# Altium project CMUX.PrjPcb
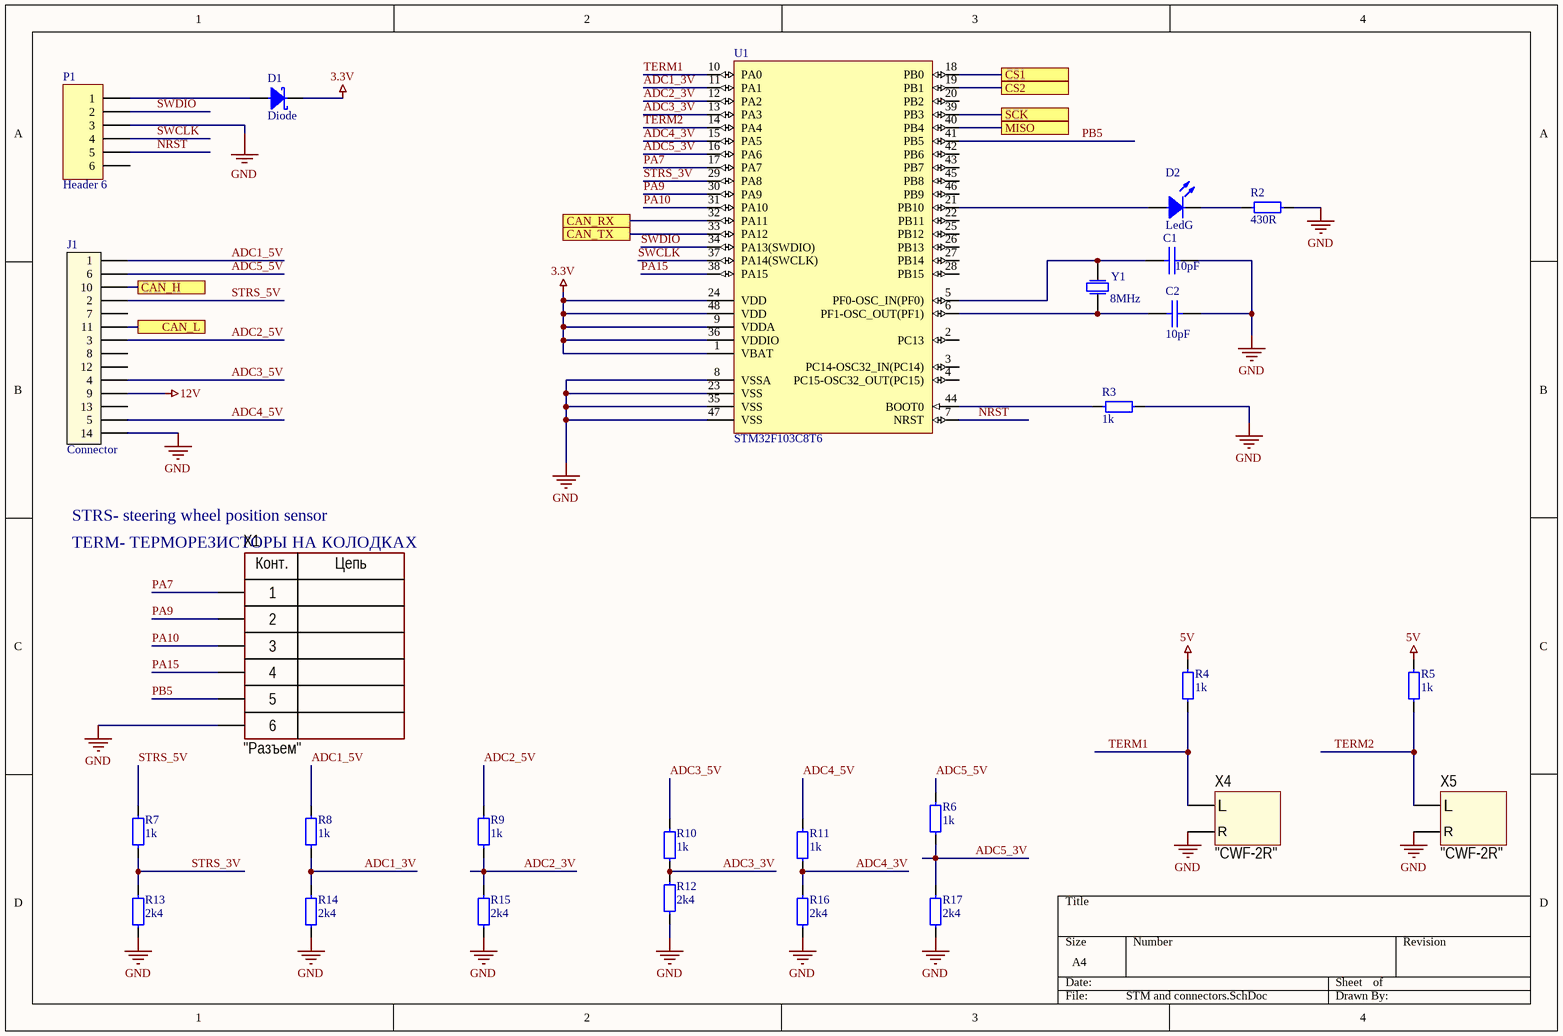
[diagram p0: STM and connectors.SchDoc]
2 sheets, 47 parts. Net scope: flat (ports and power ports of the same name join across sheets).
Board file: PCB.PcbDoc
Sheets:
  STM and connectors.SchDoc
  Power and can.SchDoc

## Sheet STM and connectors.SchDoc
size A4

### Parts
C1  10pF  [0805 Capicator]
C2  10pF  [0805 Capicator]
D1  Diode  [SMA]
D2  LedG  [0805 LED]
J1  Connector  [AMP 776266-1]
P1  Header 6  [HDR1X6]
R2  430R  [0805 Resistor]
R3  1k  [0805 Resistor]
R4  1k  [0805 Resistor]
R5  1k  [0805 Resistor]
R6  1k  [0805 Resistor]
R7  1k  [0805 Resistor]
R8  1k  [0805 Resistor]
R9  1k  [0805 Resistor]
R10  1k  [0805 Resistor]
R11  1k  [0805 Resistor]
R12  2k4  [0805 Resistor]
R13  2k4  [0805 Resistor]
R14  2k4  [0805 Resistor]
R15  2k4  [0805 Resistor]
R16  2k4  [0805 Resistor]
R17  2k4  [0805 Resistor]
U1  STM32F103C8T6  [LQFP48]
X1  CommentText: "Разъем"  [CON: PLD-6]
X4  CommentText: "CWF-2R"  [CON: CWF-2R]
X5  CommentText: "CWF-2R"  [CON: CWF-2R]
Y1  8MHz  [R38]

### Ports
CAN_H, CAN_L, CAN_RX, CAN_TX, CS1, CS2, MISO, SCK

### Nets
3.3V: D1.2 U1.1(VBAT) U1.9(VDDA) U1.24(VDD) U1.36(VDDIO) U1.48(VDD)
5V: R4.2 R5.2
12V: J1.9
GND: C1.2 C2.2 J1.14 P1.3 R2.2 R3.2 R12.2 R13.2 R14.2 R15.2 R16.2 R17.2 U1.8(VSSA) U1.23(VSS) U1.35(VSS) U1.47(VSS) X1.6 X4.2(R) X5.2(R)
ADC1_3V: R8.1 R14.1 U1.11(PA1)
ADC1_5V: J1.1 R8.2
ADC2_3V: R9.1 R15.1 U1.12(PA2)
ADC2_5V: J1.3 R9.2
ADC3_3V: R10.1 R12.1 U1.13(PA3)
ADC3_5V: J1.4 R10.2
ADC4_3V: R11.1 R16.1 U1.15(PA5)
ADC4_5V: J1.5 R11.2
ADC5_3V: R6.1 R17.1 U1.16(PA6)
ADC5_5V: J1.6 R6.2
NRST: P1.5 U1.7(NRST)
PA7: U1.17(PA7) X1.1
PA9: U1.30(PA9) X1.2
PA10: U1.31(PA10) X1.3
PA15: U1.38(PA15) X1.4
PB5: U1.41(PB5) X1.5
STRS_3V: R7.1 R13.1 U1.29(PA8)
STRS_5V: J1.2 R7.2
SWCLK: P1.4 U1.37(PA14(SWCLK))
SWDIO: P1.2 U1.34(PA13(SWDIO))
TERM1: R4.1 U1.10(PA0) X4.1(L)
TERM2: R5.1 U1.14(PA4) X5.1(L)
NetC1_1: C1.1 U1.5(PF0-OSC_IN(PF0)) Y1.2
NetC2_1: C2.1 U1.6(PF1-OSC_OUT(PF1)) Y1.1
NetD1_1: D1.1 P1.1
NetD2_1: D2.1 U1.21(PB10)
NetD2_2: D2.2 R2.1
NetD3_1: J1.10 ; port CAN_H
NetD3_2: J1.11 ; port CAN_L
NetR3_1: R3.1 U1.44(BOOT0)
NetU1_18: U1.18(PB0) ; port CS1
NetU1_19: U1.19(PB1) ; port CS2
NetU1_32: U1.32(PA11) ; port CAN_RX
NetU1_33: U1.33(PA12) ; port CAN_TX
NetU1_39: U1.39(PB3) ; port SCK
NetU1_40: U1.40(PB4) ; port MISO

Not connected (* = marked no-connect by the designer): J1 7 8 12 13; P1 6; U1 2(PC13) 3(PC14-OSC32_IN(PC14)) 4(PC15-OSC32_OUT(PC15)) 20(PB2) 22(PB11) 25(PB12) 26(PB13) 27(PB14) 28(PB15) 42(PB6) 43(PB7) 45(PB8) 46(PB9)

### Notes on the sheet
- STRS- steering wheel position sensor
- (near X1) TERM- ТЕРМОРЕЗИСТОРЫ НА КОЛОДКАХ
- (in symbol PLD-6) Конт.; Цепь

### Library data of the parts
C1 C2 = Cap 10pF (0805): 10pF NP0 50V 5% 0805; Manufacturer: Murata Manufacturing; Part Number: GRM2165C1H100JZ01D; Type: Capacitor; ComponentLink1Description: Chip&Dip; ComponentLink1URL: https://www.chipdip.ru/product/grm2165c1h100j
D1 = Diode Schottky (SMA): Diode Schottky 3A 40V; Part Number: B340A-E3/61T; Manufacturer: Vishay; Type: Diode; ComponentLink1Description: DataSheet; ComponentLink1URL: https://static.chipdip.ru/lib/652/DOC001652710.pdf; ComponentLink2Description: Chip&Dip; ComponentLink2URL: https://www.chipdip.ru/product/b340a-e3-61t-2
D2 = Led Green: Led Green SMD 1608, 120°, 525nM; Part Number: TO-1608BC-PG; Manufacturer: Taiwan Oasis Technology; Type: Diode; ComponentLink1Description: Chip&Dip; ComponentLink1URL: https://www.chipdip.ru/product/to-1608bc-pg
J1 = Connector AMP: AMP Connector; Part Number: 776266-1; Manufacturer: TE Connectivity; Type: Connector
P1 = Header 6: Header, 6-Pin; LatestRevisionDate: 17-Jul-2002; LatestRevisionNote: Re-released for DXP Platform.; Publisher: Altium Limited
R2 = Res 430R (0805): 0.125W 0805 430R, 1%; Part Number: RC0805FR-07430RL; Manufacturer: Taiwan; Type: Resistor; ComponentLink1Description: Chip&Dip; ComponentLink1URL: https://www.chipdip.ru/product0/9000079477
R3-R11 = Res 1k (0805): 0.125W 0805 1k, 1%; Part Number: RC0805FR-071KL; Manufacturer: Taiwan; Type: Resistor; ComponentLink1Description: Chip&Dip; ComponentLink1URL: https://www.chipdip.ru/product0/9000079486
R12-R17 = Res 2.4k (0805): 0.125W 0805 2.4k, 1%; Part Number: RC0805FR-072K4L; Manufacturer: Taiwan; Type: Resistor; ComponentLink1Description: Chip&Dip; ComponentLink1URL: https://www.chipdip.ru/product0/9000079495
U1 = STM32F103C8T6: Cortex™-M3 32-bit RISC core operating at a 72 MHz frequency; Manufacturer: STMicroelectronics; Part Number: STM32F103C8T6; ComponentLink1Description: DataSheet; ComponentLink1URL: https://static.chipdip.ru/lib/235/DOC000235733.pdf; ComponentLink2Description: Chip&Dip; ComponentLink2URL: https://www.chipdip.ru/product/stm32f103c8t6; Type: IC
X1 = PLD-6: Manufacturer: Connfly; ValueManufacturerPartNumber: Connector, 6pin, 2.54mm, 500VAC, 3A; TypeConnector: Connector; VoltageMax: 500VAC; Pitch: 2.54mm; CurrentMax: 3A; Multichannel: 6pin; HelpURL: https://www.chipdip.ru/product/pld-6; PartNumber: PLD-6
X4 X5 = CWF-2R: Manufacturer: Connfly; ValueManufacturerPartNumber: Connector, 2pin, 2.54mm, 250VAC, 3A; TypeConnector: Connector; VoltageMax: 250VAC; Pitch: 2.54mm; CurrentMax: 3A; Multichannel: 2pin; HelpURL: https://www.chipdip.ru/product/cwf-2r-ds1069-2-mr; PartNumber: CWF-2R; ComponentLink1Description: CHIP&DIP; ComponentLink1URL: https://www.chipdip.ru/product/cwf-2r-ds1069-2-mr
Y1 = Crystal 8MHz: Crystal. HC-49S (US); Manufacturer: China; Part Number: 8.000MHzHC-49US; Type: Crystal; ComponentLink1Description: Chip&Dip; ComponentLink1URL: https://www.chipdip.ru/product/8mhz-hc-49s

## Sheet Power and can.SchDoc
size A4
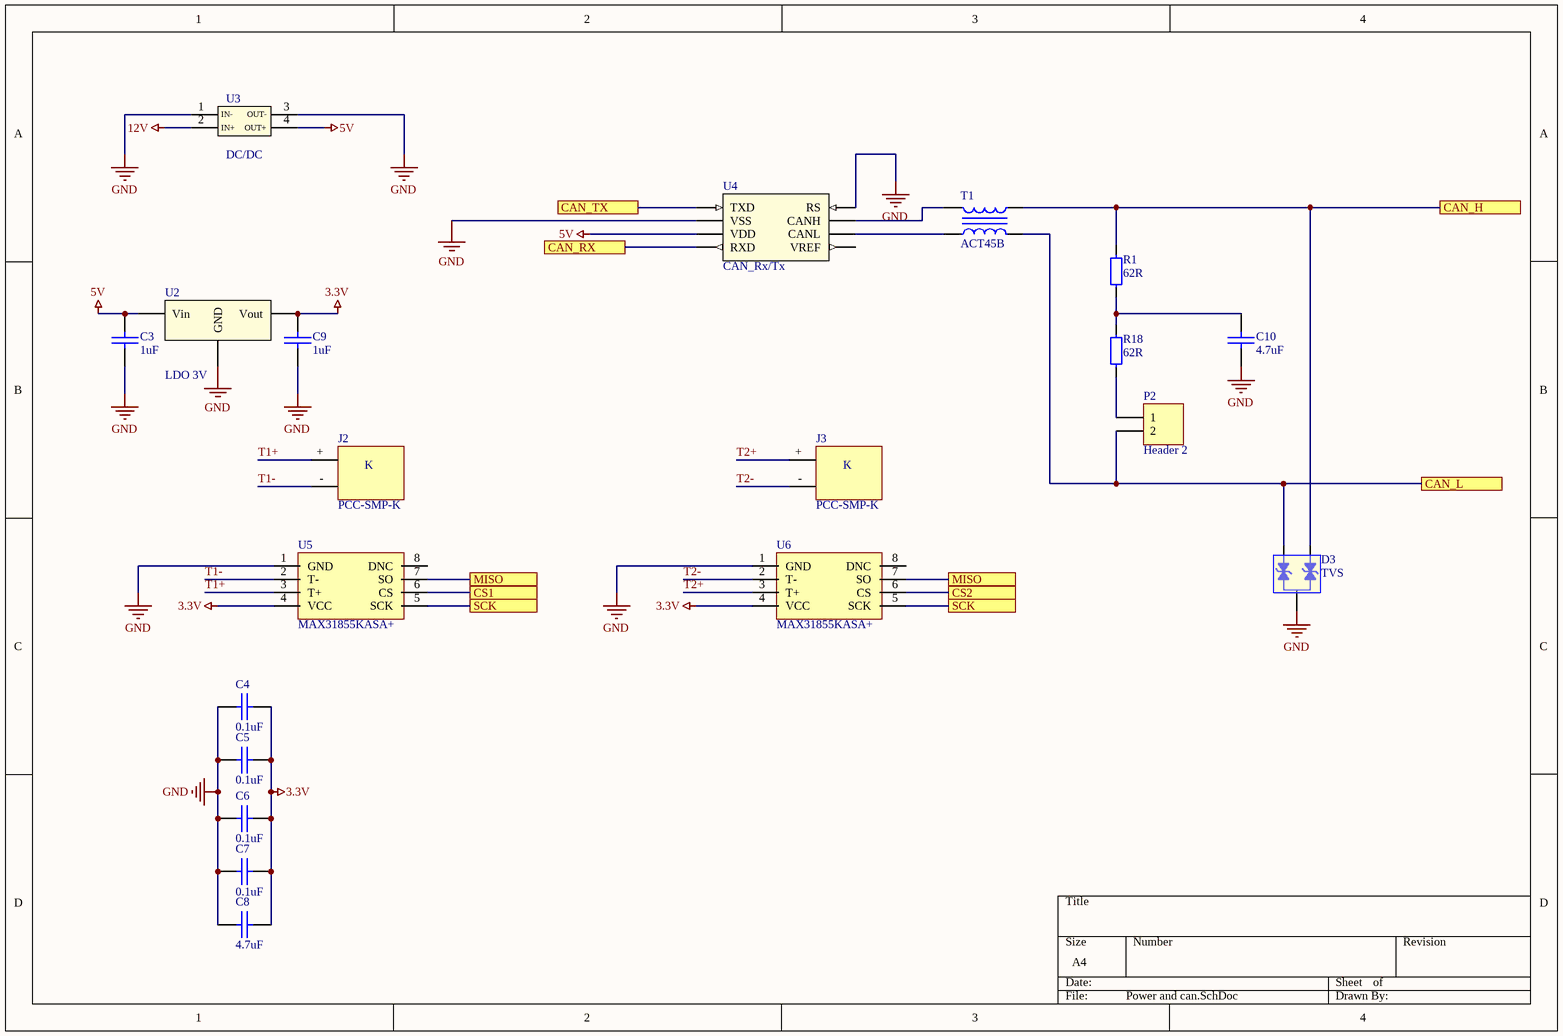
[diagram p1: Power and can.SchDoc]

### Parts
C3  1uF  [0805 Capicator]
C4  0.1uF  [0805 Capicator]
C5  0.1uF  [0805 Capicator]
C6  0.1uF  [0805 Capicator]
C7  0.1uF  [0805 Capicator]
C8  4.7uF  [0805 Capicator]
C9  1uF  [0805 Capicator]
C10  4.7uF  [0805 Capicator]
D3  TVS  [SOT-23]
J2  PCC-SMP-K  [thermocouple]
J3  PCC-SMP-K  [thermocouple]
P2  Header 2  [HDR1X2]
R1  62R  [0805 Resistor]
R18  62R  [0805 Resistor]
T1  ACT45B  [ACT45B]
U2  LDO 3V  [SOT-23]
U3  DC/DC  [DC-DC]
U4  CAN_Rx/Tx  [SO-8]
U5  MAX31855KASA+  [SO-8]
U6  MAX31855KASA+  [SO-8]

### Ports
CAN_H, CAN_L, CAN_RX, CAN_TX, CS1, CS2, MISO, SCK

### Nets
3.3V: C4.1 C5.1 C6.1 C7.1 C8.2 C9.1 U2.2(Vout) U5.4(VCC) U6.4(VCC)
5V: C3.2 U2.3(Vin) U3.4(OUT+) U4.3(VDD)
12V: U3.2(IN+)
GND: C3.1 C4.2 C5.2 C6.2 C7.2 C8.1 C9.2 C10.1 D3.3 U2.1(GND) U3.1(IN-) U3.3(OUT-) U4.2(VSS) U4.8(RS) U5.1(GND) U6.1(GND)
T1+: J2.+ U5.3(T+)
T1-: J2.- U5.2(T-)
T2+: J3.+ U6.3(T+)
T2-: J3.- U6.2(T-)
NetC10_2: C10.2 R1.1 R18.2
NetD3_1: D3.1 R1.2 T1.4 ; port CAN_H
NetD3_2: D3.2 P2.2 T1.3 ; port CAN_L
NetP2_1: P2.1 R18.1
NetT1_1: T1.1 U4.7(CANH)
NetT1_2: T1.2 U4.6(CANL)
NetU1_18: U5.6(CS) ; port CS1
NetU1_19: U6.6(CS) ; port CS2
NetU1_32: U4.4(RXD) ; port CAN_RX
NetU1_33: U4.1(TXD) ; port CAN_TX
NetU1_39: U5.5(SCK) U6.5(SCK) ; port SCK
NetU1_40: U5.7(SO) U6.7(SO) ; port MISO

Not connected (* = marked no-connect by the designer): U4 5(VREF); U5 8(DNC); U6 8(DNC)

### Notes on the sheet
- (in symbol thermocoupleconnector) K

### Library data of the parts
C3 C9 = Cap 1uF (0805): 1uF X7R 10% 16V 0805; Manufacturer: Murata Manufacturing; Part Number: GRM21BR71C105KA01K; Type: Capacitor; ComponentLink1Description: Chip&Dip; ComponentLink1URL: https://www.chipdip.ru/product/grm21br71c105k
C4-C7 = Cap 0.1uF (0805): 0.1uF X7R 50V 10% 0805; Manufacturer: Murata Manufacturing; Part Number: GRM21BR71H104K; Type: Capacitor; ComponentLink1Description: Chip&Dip; ComponentLink1URL: https://www.chipdip.ru/product/grm21br71h104k
C8 C10 = Cap 4.7uF (0805): 4.7uF X5R 10% 25V 0805; Manufacturer: Murata Manufacturing; Part Number: GRM21BR61E475KA12L; Type: Capacitor; ComponentLink1Description: Chip&Dip; ComponentLink1URL: https://www.chipdip.ru/product/grm21br61e475ka12l
D3 = TVS Diode Arrays: Part Number: SM24CANB-02HTG; Manufacturer: Littelfuse; Type: Diode; ComponentLink1Description: DataSheet; ComponentLink1URL: https://m.littelfuse.com/~/media/electronics/datasheets/tvs_diode_arrays/littelfuse_tvs_diode_array_sm24canb_datasheet.pdf.pdf; ComponentLink2Description: Chip&Dip; ComponentLink2URL: https://www.chipdip.ru/product1/8001779022
J2 J3 = thermocoupleconnector
P2 = Header 2: Header, 2-Pin; LatestRevisionDate: 17-Jul-2002; LatestRevisionNote: Re-released for DXP Platform.; Publisher: Altium Limited
R1 R18 = Res 62R (0805): 0.125W 0805 62R, 1%; Part Number: RC0805FR-0762RL; Manufacturer: Taiwan; Type: Resistor; ComponentLink1Description: Chip&Dip; ComponentLink1URL: https://www.chipdip.ru/product0/9000079457
T1 = ACT45B: Common mode filters / Automotive signal line (for power train/safety); Manufacturer: EMC Components; Part Number: ACT45B-510-2P-TL003; Type: Inductor; ComponentLink1Description: DataSheet; ComponentLink1URL: https://product.tdk.com/info/en/catalog/datasheets/cmf_automotive_signal_act45b_en.pdf
U2 = LDO 3V [MCP]: MCP1702 Low Dropout Voltage Regulator. The input operating range is specifiedfrom 2.7V to 13.2V; Part Number: MCP1702T-3002E/CB; Manufacturer: Microchip; ComponentLink1Description: DataSheet; ComponentLink1URL: https://static.chipdip.ru/lib/986/DOC003986671.pdf; ComponentLink2Description: Chip&Dip; ComponentLink2URL: https://www.chipdip.ru/product/mcp1702t-3002e-cb-microchip
U3 = DC/DC: DC/DC 5V with MP2307 Chip
U4 = CAN Transceiver [MCP2551]: High-speed  CAN,  fault-tolerantdevice  that  serves  as  the  interface  between  a  CANprotocol controller and the physical bus.; Part Number: MCP2551-I/SN; Manufacturer: Microchip; ComponentLink1Description: DataSheet; ComponentLink1URL: https://static.chipdip.ru/lib/204/DOC000204457.pdf; ComponentLink2Description: Chip&Dip; ComponentLink2URL: https://www.chipdip.ru/product/mcp2551-i-sn; Type: IC
U5 U6 = MAX31855KASA+: ComponentLink1Description: CHIP&DIP; ComponentLink1URL: https://www.chipdip.ru/product/max31855kasa; ComponentLink2Description: Datasheet; ComponentLink2URL: https://static.chipdip.ru/lib/121/DOC001121138.pdf

## Nets that join several sheets
3.3V: STM and connectors (6 pins), Power and can (9 pins)
5V: STM and connectors (R4.2 R5.2), Power and can (C3.2 U2.3 U3.4 U4.3)
12V: STM and connectors (J1.9), Power and can (U3.2)
GND: STM and connectors (19 pins), Power and can (16 pins)
NetD3_1: STM and connectors (J1.10), Power and can (D3.1 R1.2 T1.4)
NetD3_2: STM and connectors (J1.11), Power and can (D3.2 P2.2 T1.3)
NetU1_18: STM and connectors (U1.18), Power and can (U5.6)
NetU1_19: STM and connectors (U1.19), Power and can (U6.6)
NetU1_32: STM and connectors (U1.32), Power and can (U4.4)
NetU1_33: STM and connectors (U1.33), Power and can (U4.1)
NetU1_39: STM and connectors (U1.39), Power and can (U5.5 U6.5)
NetU1_40: STM and connectors (U1.40), Power and can (U5.7 U6.7)